# Altium schematic sheet Sensor.SchDoc
size 209 x 297 mm; PartName: Датчик Холла; Date: 03.03.2017; Author: Мурашкин Д.В.; CompanyName: Smart Shelf Eurasia; DrawnBy: Мурашкин; Address1: Address1; Address2: Address2; Address3: Address3; Address4: Address4; DocumentNumber: SS19946-COSHP-R03-03; SheetNumber: 3; SheetTotal: 3; Scale: -; Letter1Column: Э; CurrentDate: 03.03.2017
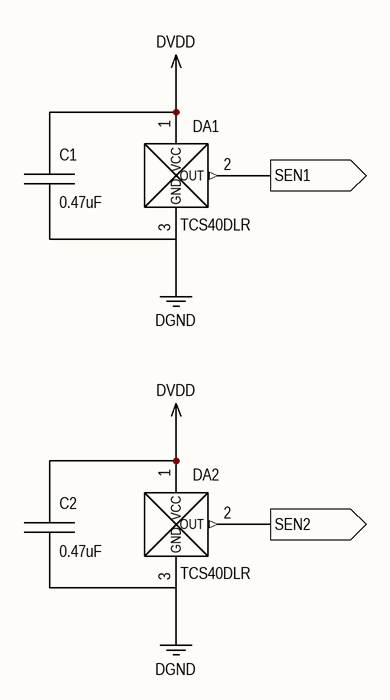
[diagram p0: Sensor.SchDoc]

## Parts
C1  0.47uF  [CAPC1608L]
C2  0.47uF  [CAPC1608L]
DA1  TCS40DLR  [SOT-23F]
DA2  TCS40DLR  [SOT-23F]

## Ports
SEN1 (out), SEN2 (out)

## Nets
DGND: C1.2 C2.2 DA1.3(GND) DA2.3(GND)
DVDD: C1.1 C2.1 DA1.1(VCC) DA2.1(VCC)
SEN1: DA1.2(OUT) ; port SEN1
SEN2: DA2.2(OUT) ; port SEN2

## Notes on the sheet
- Перв. примен.
- Справ. №
- Подп. и дата
- Инв. № дубл.
- Взам. инв. №
- Разраб.
- Изм.
- Лист
- № докум.
- Подп.
- Дата
- Лит.
- Масса
- Масштаб
- Пров.
- Т.контр.
- Листов
- Инв. № подл.
- Утв.
- Н.контр.
- 2.106-A4
- Копировал
- Формат А4

## Library data of the parts
C1 C2 = CC0603KRX7R6BB474: Capacitor Ceramic 0.47uF 10V; Manufacturer: Yageo; Group: Ceramic Capacitors; Temperature Coefficient: X7R; Tolerance: ±10%; Short description: CAP CER 0.47UF 10V X7R 0603; Type: Ceramic; Part name: CC0603KRX7R6BB474; Voltage: 10 V; Package: 1608; Value: 0.47uF
DA1 DA2 = TCS40DLR: Magnetic Sensor Digital Output; Manufacturer: TOSHIBA; Group: Sensors; Short description: IC HALL EFFECT SENSOR SOT23F; Package: SOT-23F; Part name: TCS40DLR